# Altium schematic sheet STM32F103C8T6.SchDoc
size A1
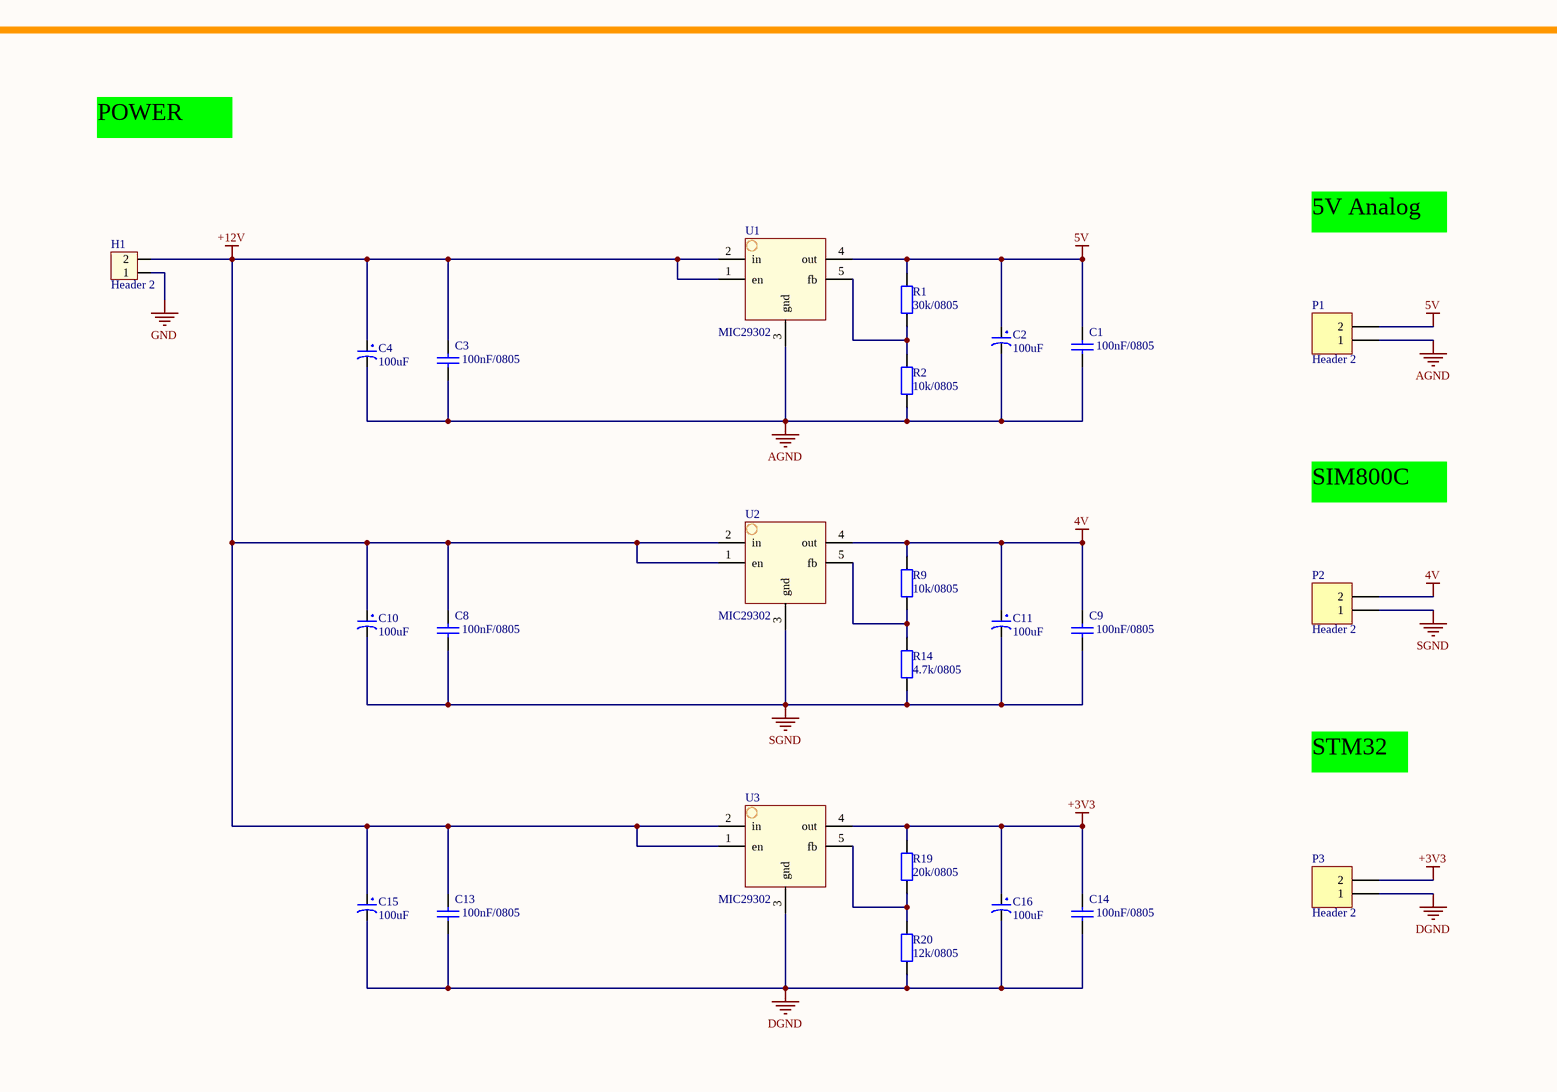
[diagram p0: STM32F103C8T6.SchDoc, top left]
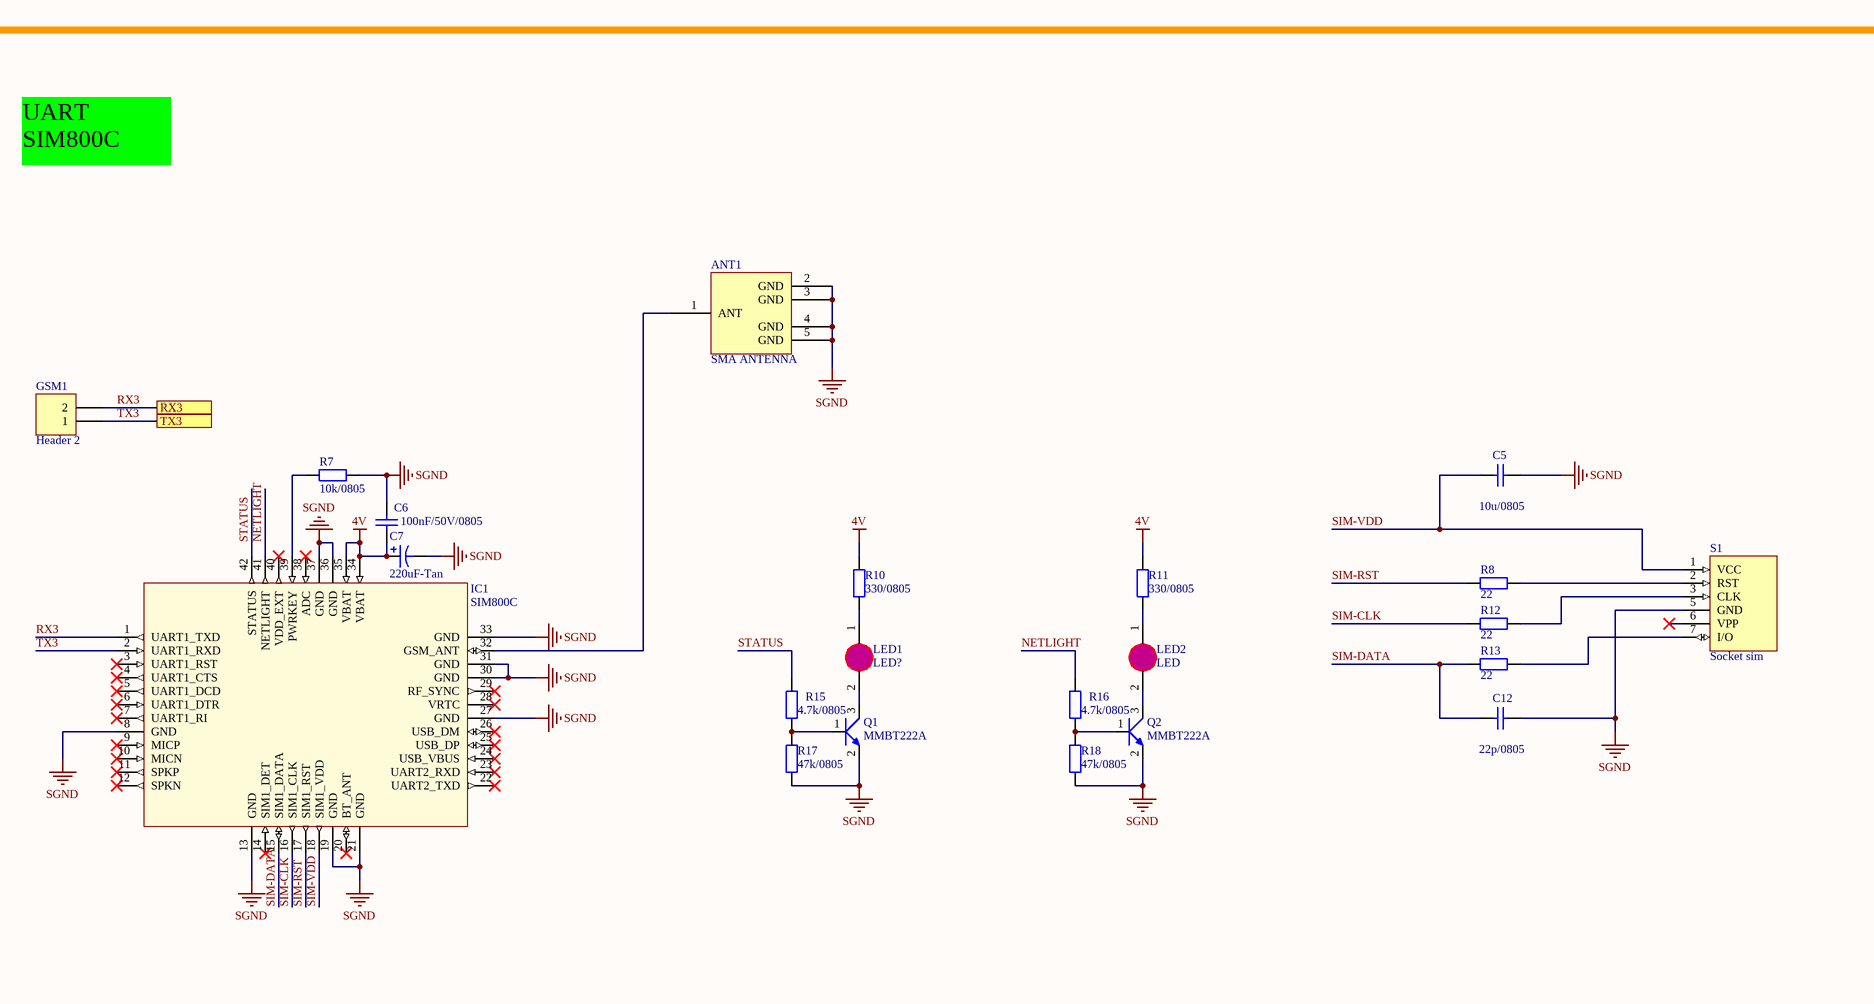
[diagram p1: STM32F103C8T6.SchDoc, top right]
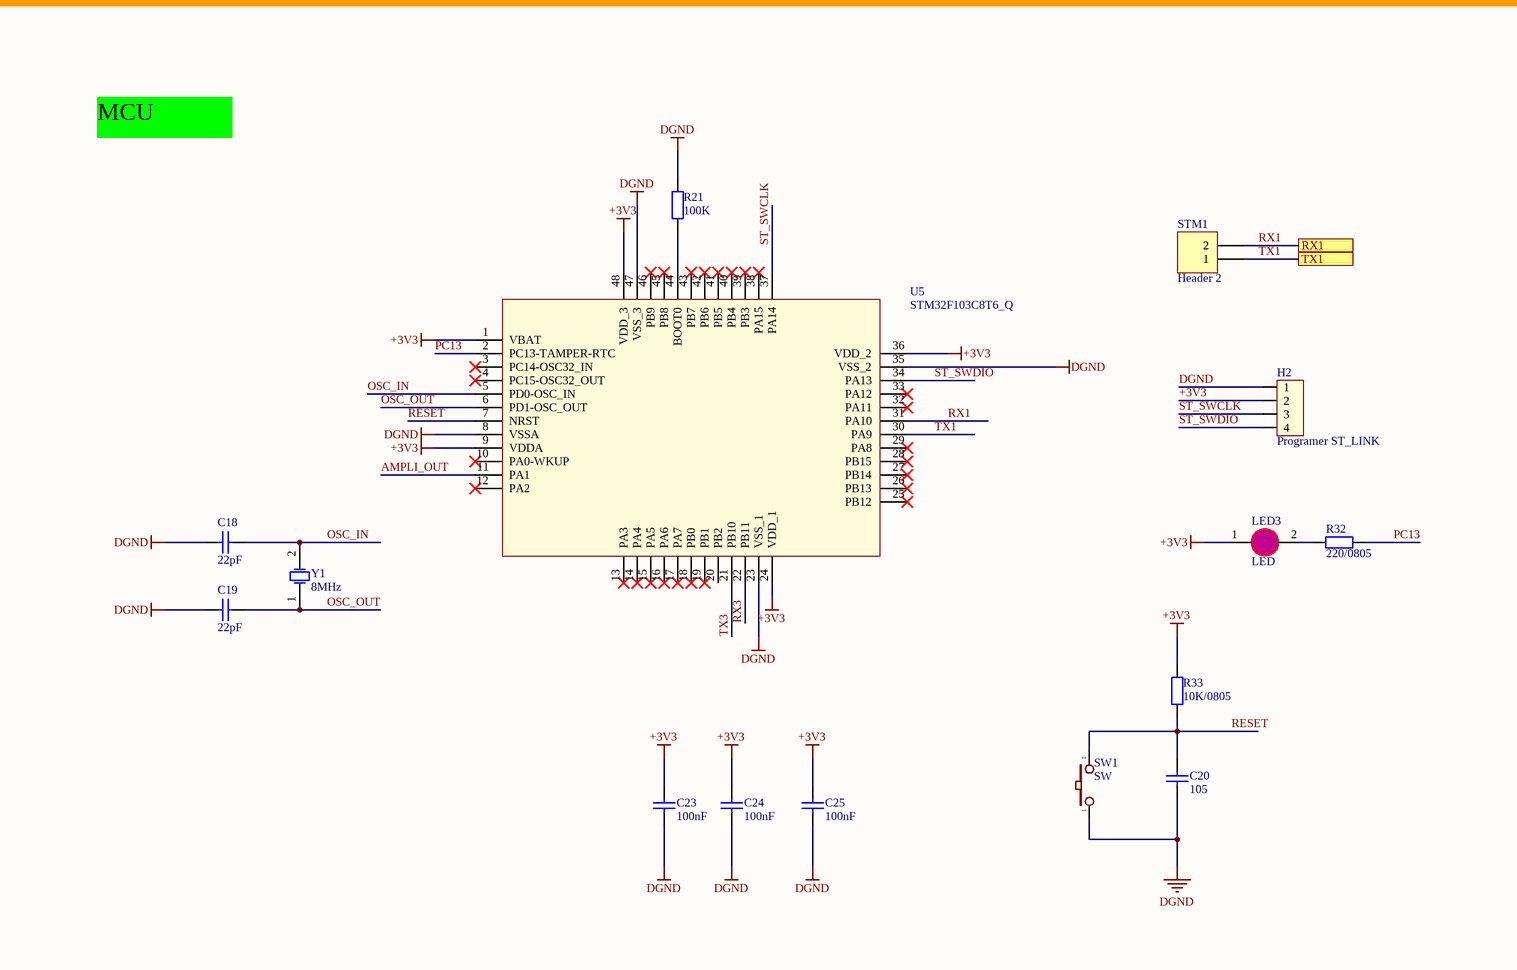
[diagram p2: STM32F103C8T6.SchDoc, bottom left]
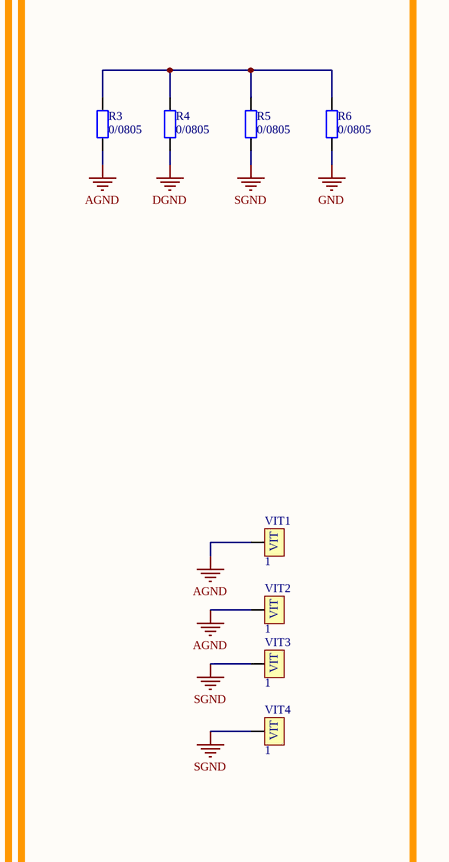
[diagram p3: STM32F103C8T6.SchDoc, bottom right]

## Parts
ANT1  SMA ANTENNA  [ANT-SMA-ST-F]
C1  100nF/0805  [C0805-2012]
C2  100uF  [CAP_TANTA_10UF_35V]
C3  100nF/0805  [C0805-2012]
C4  100uF  [CAP_TANTA_10UF_35V]
C5  10u/0805  [C0805-2012]
C6  100nF/50V/0805  [C0805-2012]
C7  220uF-Tan  [CAP_TANTA_10UF_35V]
C8  100nF/0805  [C0805-2012]
C9  100nF/0805  [C0805-2012]
C10  100uF  [CAP_TANTA_10UF_35V]
C11  100uF  [CAP_TANTA_10UF_35V]
C12  22p/0805  [C0805-2012]
C13  100nF/0805  [C0805-2012]
C14  100nF/0805  [C0805-2012]
C15  100uF  [CAP_TANTA_10UF_35V]
C16  100uF  [CAP_TANTA_10UF_35V]
C18  value 22pF  [C0805-2012]  (hidden comment: Cap)
C19  value 22pF  [C0805-2012]  (hidden comment: Cap)
C20  value 105  [C0805-2012]  (hidden comment: Cap)
C23  value 100nF  [C0805-2012]  (hidden comment: Cap)
C24  value 100nF  [C0805-2012]  (hidden comment: Cap)
C25  value 100nF  [C0805-2012]  (hidden comment: Cap)
GSM1  Header 2  [Header_2]
H1  Header 2  [DOMINO2_GREEN]
H2  Programer ST_LINK  [Header_4]
IC1  SIM800C  [SIM800C]
LED1  LED?  [Led 0805R]
LED2  LED  [Led 0805R]
LED3  LED  [Led 0805G]
P1  Header 2  [Header_2]
P2  Header 2  [Header_2]
P3  Header 2  [Header_2]
Q1  MMBT222A  [MMBT2222A]
Q2  MMBT222A  [MMBT2222A]
R1  30k/0805  [RESC2012(0805)]
R2  10k/0805  [RESC2012(0805)]
R3  value 0/0805  [RESC2012(0805)]  (hidden comment: R0805)
R4  value 0/0805  [RESC2012(0805)]  (hidden comment: R0805)
R5  value 0/0805  [RESC2012(0805)]  (hidden comment: R0805)
R6  value 0/0805  [RESC2012(0805)]  (hidden comment: R0805)
R7  10k/0805  [RESC2012(0805)]
R8  value 22  [RESC2012(0805)]  (hidden comment: R0805)
R9  10k/0805  [RESC2012(0805)]
R10  value 330/0805  [RESC2012(0805)]  (hidden comment: R0805)
R11  value 330/0805  [RESC2012(0805)]  (hidden comment: R0805)
R12  value 22  [RESC2012(0805)]  (hidden comment: R0805)
R13  value 22  [RESC2012(0805)]  (hidden comment: R0805)
R14  4.7k/0805  [RESC2012(0805)]
R15  value 4.7k/0805  [RESC2012(0805)]  (hidden comment: R0805)
R16  value 4.7k/0805  [RESC2012(0805)]  (hidden comment: R0805)
R17  value 47k/0805  [RESC2012(0805)]  (hidden comment: R0805)
R18  value 47k/0805  [RESC2012(0805)]  (hidden comment: R0805)
R19  20k/0805  [RESC2012(0805)]
R20  12k/0805  [RESC2012(0805)]
R21  value 100K  [RESC2012(0805)]  (hidden comment: Res2)
R32  value 220/0805  [RESC2012(0805)]  (hidden comment: R0805)
R33  value 10K/0805  [RESC2012(0805)]  (hidden comment: R0805)
S1  Socket sim  [Card Sim]
STM1  Header 2  [Header_2]
SW1  SW  [BUTTON SMD EVQ - 2PIN]
U1  MIC29302  [MIC29302]
U2  MIC29302  [MIC29302]
U3  MIC29302  [MIC29302]
U5  STM32F103C8T6_Q  [STM32F103C8T6_Q]
VIT1  1  [VIT]
VIT2  1  [VIT]
VIT3  1  [VIT]
VIT4  1  [VIT]
Y1  8MHz  [CRYSTAL]

## Ports
RX1, RX3, TX1, TX3

## Nets
4V: C6.1 C7.1 C9.2 C11.1 IC1.34(VBAT) IC1.35(VBAT) P2.2 R9.2 R10.1 R11.1 U2.4(out)
5V: C1.2 C2.1 P1.2 R1.2 U1.4(out)
+3V3: C14.2 C16.1 C23.2 C24.2 C25.2 H2.2 LED3.1(A) P3.2 R19.2 R33.1 U3.4(out) U5.1(VBAT) U5.9(VDDA) U5.24(VDD_1) U5.36(VDD_2) U5.48(VDD_3)
+12V: C3.2 C4.1 C8.2 C10.1 C13.2 C15.1 H1.2 U1.1(en) U1.2(in) U2.1(en) U2.2(in) U3.1(en) U3.2(in)
AGND: C1.1 C2.2 C3.1 C4.2 P1.1 R2.1 R3.1 U1.3(gnd) VIT1.VIT1 VIT2.VIT1
DGND: C13.1 C14.1 C15.2 C16.2 C18.1 C19.1 C20.1 C23.1 C24.1 C25.1 H2.1 P3.1 R4.1 R20.1 R21.2 SW1.1 U3.3(gnd) U5.8(VSSA) U5.23(VSS_1) U5.35(VSS_2) U5.47(VSS_3)
GND: H1.1 R6.1
SGND: ANT1.2(GND) ANT1.3(GND) ANT1.4(GND) ANT1.5(GND) C5.2 C6.2 C7.2 C8.1 C9.1 C10.2 C11.2 C12.2 IC1.8(GND) IC1.13(GND) IC1.19(GND) IC1.21(GND) IC1.27(GND) IC1.30(GND) IC1.31(GND) IC1.33(GND) IC1.36(GND) IC1.37(GND) P2.1 Q1.2 Q2.2 R5.1 R7.2 R14.1 R17.2 R18.2 S1.5(GND) U2.3(gnd) VIT3.VIT1 VIT4.VIT1
AMPLI_OUT: U5.11(PA1)
NETLIGHT: IC1.41(NETLIGHT) R16.1
OSC_IN: C18.2 U5.5(PD0-OSC_IN) Y1.2(OSC2)
OSC_OUT: C19.2 U5.6(PD1-OSC_OUT) Y1.1(OSC1)
PC13: R32.2 U5.2(PC13-TAMPER-RTC)
RESET: C20.2 R33.2 SW1.2 U5.7(NRST)
RX1: STM1.2 U5.31(PA10) ; port RX1
RX3: GSM1.2 IC1.1(UART1_TXD) U5.22(PB11) ; port RX3
SIM-CLK: IC1.16(SIM1_CLK) R12.1
SIM-DATA: C12.1 IC1.15(SIM1_DATA) R13.1
SIM-RST: IC1.17(SIM1_RST) R8.1
SIM-VDD: C5.1 IC1.18(SIM1_VDD) S1.1(VCC)
ST_SWCLK: H2.3 U5.37(PA14)
ST_SWDIO: H2.4 U5.34(PA13)
STATUS: IC1.42(STATUS) R15.1
TX1: STM1.1 U5.30(PA9) ; port TX1
TX3: GSM1.1 IC1.2(UART1_RXD) U5.21(PB10) ; port TX3
NetANT1_1: ANT1.1(ANT) IC1.32(GSM_ANT)
NetIC1_39: IC1.39(PWRKEY) R7.1
NetLED1_1: LED1.1(A) R10.2
NetLED1_2: LED1.2(K) Q1.3
NetLED2_1: LED2.1(A) R11.2
NetLED2_2: LED2.2(K) Q2.3
NetLED3_2: LED3.2(K) R32.1
NetQ1_1: Q1.1 R15.2 R17.1
NetQ2_1: Q2.1 R16.2 R18.1
NetR1_1: R1.1 R2.2 U1.5(fb)
NetR3_2: R3.2 R4.2 R5.2 R6.2
NetR8_2: R8.2 S1.2(RST)
NetR9_1: R9.1 R14.2 U2.5(fb)
NetR12_2: R12.2 S1.3(CLK)
NetR13_2: R13.2 S1.7(I/O)
NetR19_1: R19.1 R20.2 U3.5(fb)
NetR21_1: R21.1 U5.44(BOOT0)

Not connected (* = marked no-connect by the designer): IC1 3(UART1_RST)* 4(UART1_CTS)* 5(UART1_DCD)* 6(UART1_DTR)* 7(UART1_RI)* 9(MICP)* 10(MICN)* 11(SPKP)* 12(SPKN)* 14(SIM1_DET)* 20(BT_ANT)* 22(UART2_TXD)* 23(UART2_RXD)* 24(USB_VBUS)* 25(USB_DP)* 26(USB_DM)* 28(VRTC)* 29(RF_SYNC)* 38(ADC)* 40(VDD_EXT)*; S1 6(VPP)*; U5 3(PC14-OSC32_IN)* 4(PC15-OSC32_OUT)* 10(PA0-WKUP)* 12(PA2)* 13(PA3)* 14(PA4)* 15(PA5)* 16(PA6)* 17(PA7)* 18(PB0)* 19(PB1)* 20(PB2) 25(PB12)* 26(PB13)* 27(PB14)* 28(PB15)* 29(PA8)* 32(PA11)* 33(PA12)* 38(PA15)* 39(PB3)* 40(PB4)* 41(PB5)* 42(PB6)* 43(PB7)* 45(PB8)* 46(PB9)*

## Notes on the sheet
- POWER
- UART  SIM800C
- 5V Analog
- SIM800C
- STM32
- MCU
- Title
- Size:
- Date:
- File:
- A1
- Number:
- Time:
- Revision:
- Sheet
- of

## Library data of the parts
C1 C3 C8 C9 C13 C14 = CapSMD: 100nF/50V/0805; Value: 33p; Published: 8-Jun-2000; LatestRevisionDate: 17-Jul-2002; LatestRevisionNote: Re-released for DXP Platform.; PackageReference: RAD-0.3; Publisher: Altium Limited
C2 C4 C10 C11 C15 C16 = CP3: Cap 100uF/35V - 470uF/16V; Value: 100uF/35V/50V; Description 1: 1000uF/6,3V - 470uF/16V - 330uF - 25V; Description 2: 220uF/35V - 100uF/50V - 63V - 4,7uF/200V; Description 3: 22uF => 33uF100V - 3,3uF => 4,7uF/250V; Description 4: 2,2uF =>3,3uF/350 - 2,2uF/400V - 1uF/450V
C5 C12 = CapSMD: Capacitor; Value: 33p; Published: 8-Jun-2000; LatestRevisionDate: 17-Jul-2002; LatestRevisionNote: Re-released for DXP Platform.; PackageReference: RAD-0.3; Publisher: Altium Limited
C6 = CapSMD: Value: 33p; Published: 8-Jun-2000; LatestRevisionDate: 17-Jul-2002; LatestRevisionNote: Re-released for DXP Platform.; PackageReference: RAD-0.3; Publisher: Altium Limited
C7 = CAP1210-Tan
C18-C20 C23-C25 = Cap: Capacitor; Published: 8-Jun-2000; LatestRevisionDate: 17-Jul-2002; LatestRevisionNote: Re-released for DXP Platform.; PackageReference: RAD-0.3; Publisher: Altium Limited
GSM1 P1-P3 STM1 = Header 2: Header, 2-Pin; LatestRevisionDate: 17-Jul-2002; LatestRevisionNote: Re-released for DXP Platform.; Publisher: Altium Limited
H1 = Hed2: Header 2 (Green); Value: Header 2
H2 = Hed4: Header 4 (Green); Value: Header 4
IC1 = SIM800C: SIM800C V1.00
LED1-LED3 = LED0805: LED SMD 0805
R1-R20 R32 R33 = R0805: Resistor SMD 0805; Published: 8-Jun-2000; LatestRevisionDate: 17-Jul-2002; LatestRevisionNote: Re-released for DXP Platform.; PackageReference: AXIAL-0.4; Publisher: Altium Limited
R21 = Res2: Resistor; Published: 8-Jun-2000; LatestRevisionDate: 17-Jul-2002; LatestRevisionNote: Re-released for DXP Platform.; PackageReference: AXIAL-0.4; Publisher: Altium Limited
SW1 = SW2: Switch button 2 pin; Value: SW chip 2 pin
U1-U3 = MIC29302: SOC
VIT1-VIT4 = VIT: Oc Vit
Y1 = XTAL: Crystal Oscillator; Published: 8-Jun-2000; LatestRevisionDate: 17-Jul-2002; LatestRevisionNote: Re-released for DXP Platform.; PackageReference: R38; Publisher: Altium Limited